# EAGLE design JeeLabs-analog-plug (EAGLE 5.06)
ABBREV: ap2; PROJECT: Analog Plug
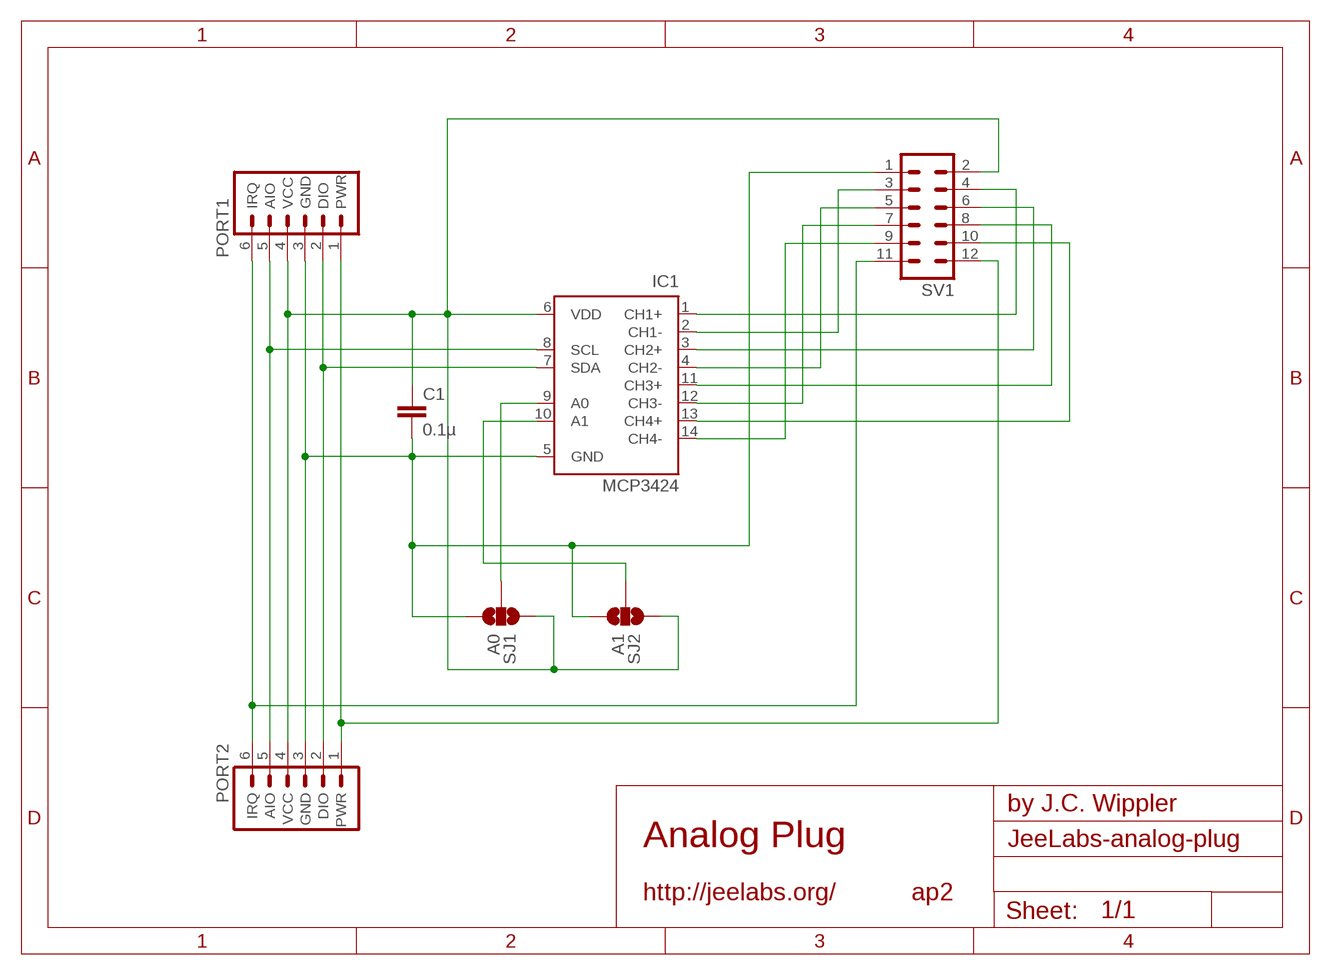
[diagram p0: schematic, sheet 1]

## Parts
C1  0.1µ  CAP0603-CAP  [0603-CAP]
IC1  MCP3424  [SO14]
PORT1  JEEPORT  JEEPORT-LONGPADS  [PORT6PIN]
PORT2  JEEPORT  JEEPORT-LONGPADS  [PORT6PIN]
SJ1  A0  SOLDERJUMPER_2WAYT  [SJ_2]
SJ2  A1  SOLDERJUMPER_2WAYT  [SJ_2]
SV1  MA06-2  [MA06-2]

## Nets
GND [power]: C1.2 IC1.5(GND) PORT1.3(GND) PORT2.3(GND) SJ1.3 SJ2.3 SV1.1
N$1: PORT1.6(IRQ) PORT2.6(IRQ) SV1.11
N$2: IC1.8(SCL) PORT1.5(AIO) PORT2.5(AIO)
N$3: IC1.1(CH1+) SV1.4
N$4: IC1.2(CH1-) SV1.3
N$5: IC1.7(SDA) PORT1.2(DIO) PORT2.2(DIO)
N$6: IC1.3(CH2+) SV1.6
N$7: IC1.4(CH2-) SV1.5
N$8: IC1.11(CH3+) SV1.8
N$9: IC1.12(CH3-) SV1.7
N$10: IC1.13(CH4+) SV1.10
N$11: IC1.14(CH4-) SV1.9
N$13: IC1.9(A0) SJ1.2
N$17: IC1.10(A1) SJ2.2
PWR [power]: PORT1.1(PWR) PORT2.1(PWR) SV1.12
VCC [power]: C1.1 IC1.6(VDD) PORT1.4(VCC) PORT2.4(VCC) SJ1.1 SJ2.1 SV1.2

## Library data of the parts
C1 = SparkFun:CAP: Capacitor Standard 0603 ceramic capacitor, and 0.1" leaded capacitor.
IC1 = JeeLabs:MCP3424: 18-Bit, 4-Channel Sampling ANALOG-TO-DIGITAL CONVERTER with I2C? Interface Source: www.ti.com .. ADS7828.pdf
PORT1 PORT2 = JeeLabs:JEEPORT: PIN HEADER
SJ1 SJ2 = SparkFun:SOLDERJUMPER_2WAY: Solder Jumper 2 way solder jumper
SV1 = JeeLabs:MA06-2: PIN HEADER

## Net classes
0 default: width 0.203 mm
1 power: width 0.381 mm

## Board
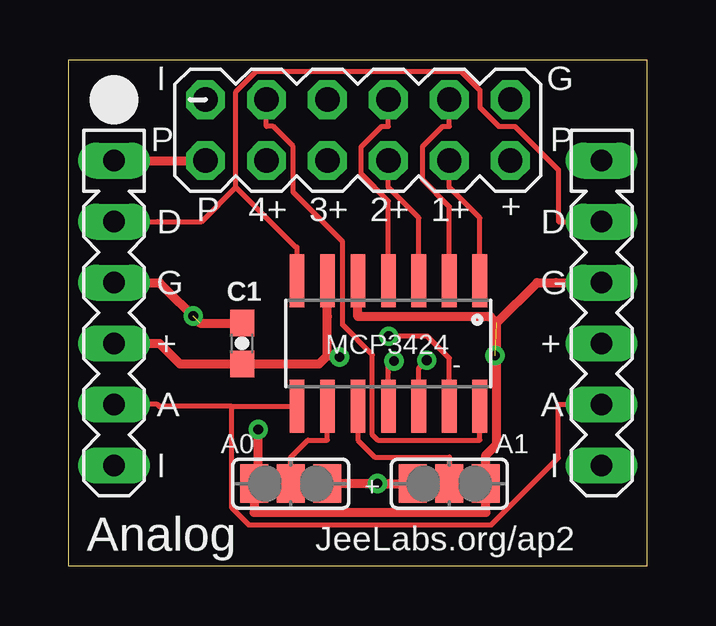
[diagram p1: board, top side]
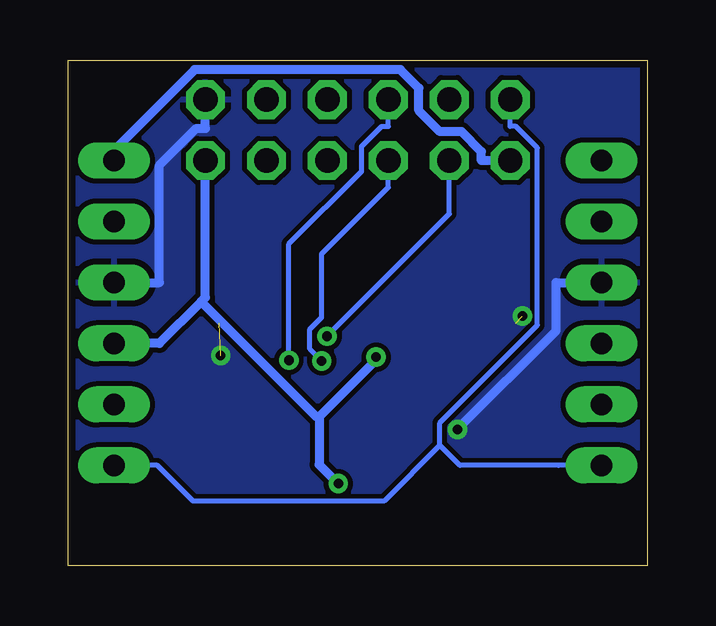
[diagram p2: board, bottom side, seen from below]

Size 24.13 x 21.08 mm. Coordinates in mm from the lower left corner, seen from the top.
Outline: 0,0 24.13,0 24.13,21.08 0,21.08 0,0
Copper layers (1*16): Top 0.035mm / dielectric 1.5mm / Bottom 0.035mm
Design rules "default *": minimum track width 8mil, minimum drill 0.4mm, track to track 8mil, track to pad 8mil, pad to pad 8mil, via to via 8mil, smd to smd 8mil, copper to edge 12mil, drill to drill 8mil, minimum pad ring 0.3mm, minimum via ring 8mil, stop-mask expansion 4mil, vias tented up to drill 20mil, thermal gap 10mil

### Footprints (pad centres in the part's own frame; a part is rotated, then mirrored left to right if it is on the bottom)
0603-CAP = smd 1.1 x 1: 1 -0.85,0; 2 0.85,0
SO14 = smd 0.61 x 2.21: 1 -3.81,-2.616; 2 -2.54,-2.616; 3 -1.27,-2.616; 4 0,-2.616; 5 1.27,-2.616; 6 2.54,-2.616; 7 3.81,-2.616; 8 3.81,2.616; 9 2.54,2.616; 10 1.27,2.616; 11 0,2.616; 12 -1.27,2.616; 13 -2.54,2.616; 14 -3.81,2.616
PORT6PIN = drill 0.9 long: 1 -6.35,0; 2 -3.81,0; 3 -1.27,0; 4 1.27,0; 5 3.81,0; 6 6.35,0
SJ_2 = smd 1.168 x 1.6: 1 -1.524,0; 2 0,0; 3 1.524,0
MA06-2 = drill 1.016 octagon: 1 -6.35,-1.27; 2 -6.35,1.27; 3 -3.81,-1.27; 4 -3.81,1.27; 5 -1.27,-1.27; 6 -1.27,1.27; 7 1.27,-1.27; 8 1.27,1.27; 9 3.81,-1.27; 10 3.81,1.27; 11 6.35,-1.27; 12 6.35,1.27

### Placement (x,y rotation side)
C1  7.24,9.27 90 top
IC1  13.34,9.27 180 top
PORT1  1.91,10.54 270 top
PORT2  22.22,10.54 270 top
SJ1  9.27,3.43 180 top
SJ2  15.88,3.43 0 top
SV1  12.06,18.16 180 top

### Tracks (layer width: path | path; a pad name or v marks a point on that pad's centre or on a via)
GND  (via drill 0.4 pad 0.81)  (2 unrouted)
  Top 0.381: 7.75,2.83 7.92,3 v7.92,5.69 | 7.75,2.83 7.75,2.24 17.4,2.24 SJ2.3 17.4,4.62 17.85,5.07 17.85,10.12 | SJ1.3 7.75,2.83 | 17.85,10.12 17.58,10.39 12.06,10.39 IC1.5 | 17.85,10.12 19.54,11.81 20.33,11.81 PORT2.3 | PORT1.3 3.8,11.81 5.49,10.12 C1.2
  Bottom 0.381: PORT1.3 3.8,11.81 3.8,9.81 v7.92,5.69 | PORT2.3 20.33,11.81 20.33,16.69 18.79,18.23 18.41,18.23 SV1.1
  other vias: 17.78,8.76 5.21,10.41
  pour Bottom: 0,21.08 24.13,21.08 24.13,0 0,0
N$1
  Bottom 0.203: 8.65,5.02 8.65,5.96 4.58,10.03 4.58,17.42 5.48,18.32 | 5.48,18.32 | 5.48,18.32 5.71,18.32 SV1.11 | 8.65,5.02 7.81,4.19 3.71,4.19 PORT1.6 | 8.65,5.02 10.97,2.7 18.93,2.7 20.42,4.19 PORT2.6
N$2
  Top 0.203: 6.8,6.65 IC1.8 | 6.8,6.65 3.79,6.65 3.71,6.73 PORT1.5 | 6.8,6.65 6.8,2.43 7.52,1.71 17.62,1.71 20.42,4.51 20.42,6.73 PORT2.5
N$3
  Top 0.203: SV1.4 15.88,15.78 17.14,14.51 IC1.1
N$4
  Top 0.203: SV1.3 15.88,18.32 15.6,18.32 14.76,17.48 14.76,16.09 15.88,14.97 IC1.2
N$5
  Top 0.203: PORT2.2 20.42,14.35 20.42,16.51 18.61,18.32 17.93,18.32 17.14,19.11 17.14,19.82 16.36,20.61 7.84,20.61 6.99,19.76 6.99,15.78 | 6.99,15.78 5.56,14.35 3.71,14.35 PORT1.2 | 6.99,15.78 9.47,13.3 9.53,13.3 IC1.7
N$6
  Top 0.203: SV1.6 13.34,15.78 14.61,14.51 IC1.3
N$7
  Top 0.203: SV1.5 13.34,18.32 13.06,18.32 12.2,17.46 12.2,16.33 13.34,15.2 IC1.4
N$8  (via drill 0.4 pad 0.81)
  Top 0.203: v13.57,8.54 13.34,8.31 13.34,8.07 IC1.11
  Bottom 0.203: v13.57,8.54 14.06,9.03 14.06,9.87 13.57,10.35 | 13.57,10.35 | 13.57,10.35 13.57,13 10.79,15.78 SV1.8
N$9  (via drill 0.4 pad 0.81)
  Top 0.203: v14.94,8.57 14.61,8.24 IC1.12
  Bottom 0.203: SV1.7 10.79,18.32 11.07,18.32 11.91,17.48 11.91,16.45 14.94,13.42 v14.94,8.57
N$10  (via drill 0.4 pad 0.81)
  Top 0.203: v13.35,9.57 14.96,9.57 15.88,8.66 IC1.13
  Bottom 0.203: SV1.10 8.26,14.67 v13.35,9.57
N$11
  Top 0.203: IC1.14 17.14,5.25 12.89,5.25 12.68,5.46 12.68,8.8 11.43,10.04 11.43,13.51 9.37,15.57 9.37,17.48 8.53,18.32 8.26,18.32 SV1.9
N$13
  Top 0.203: IC1.9 10.79,5.25 9.98,5.25 9.27,4.53 SJ1.2
N$17
  Top 0.203: IC1.10 12.06,5.25 12.78,4.53 15.88,4.53 SJ2.2
PWR
  Top 0.381: PORT1.1 SV1.12
  Bottom 0.381: SV1.12 6.92,16.89 6.92,17.27 7.74,18.09 8.64,18.09 9.53,18.97 9.53,19.91 10.3,20.68 18.87,20.68 22.22,17.32 PORT2.1
VCC  (via drill 0.4 pad 0.81)
  Top 0.381: 10.79,8.77 10.45,8.42 8.13,8.42 C1.1 4.65,8.42 3.8,9.27 PORT1.4 | 10.79,8.77 10.79,10.39 IC1.6 | v11.3,8.7 11.24,8.77 10.79,8.77 | SJ1.1 11.77,3.43 v12.88,3.43 13.37,3.43 SJ2.1
  Bottom 0.381: 18.59,11.01 20.33,9.27 PORT2.4 | SV1.2 18.41,11.19 18.59,11.01 | 13.68,6.22 13.8,6.22 18.59,11.01 | 13.68,6.22 11.3,8.6 v11.3,8.7 | v12.88,3.43 13.68,4.23 13.68,6.22

### Text on the board
tPlace: I | G | P | P | D | P | 4+ | 3+ | 2+ | 1+ | + | D | G | G | + | + | - | A | A | I | I | Analog | JeeLabs.org/ap2
_tsilk: A0 | A1 | +